# Altium schematic sheet Pressure_OUTPUT.SchDoc
size A4
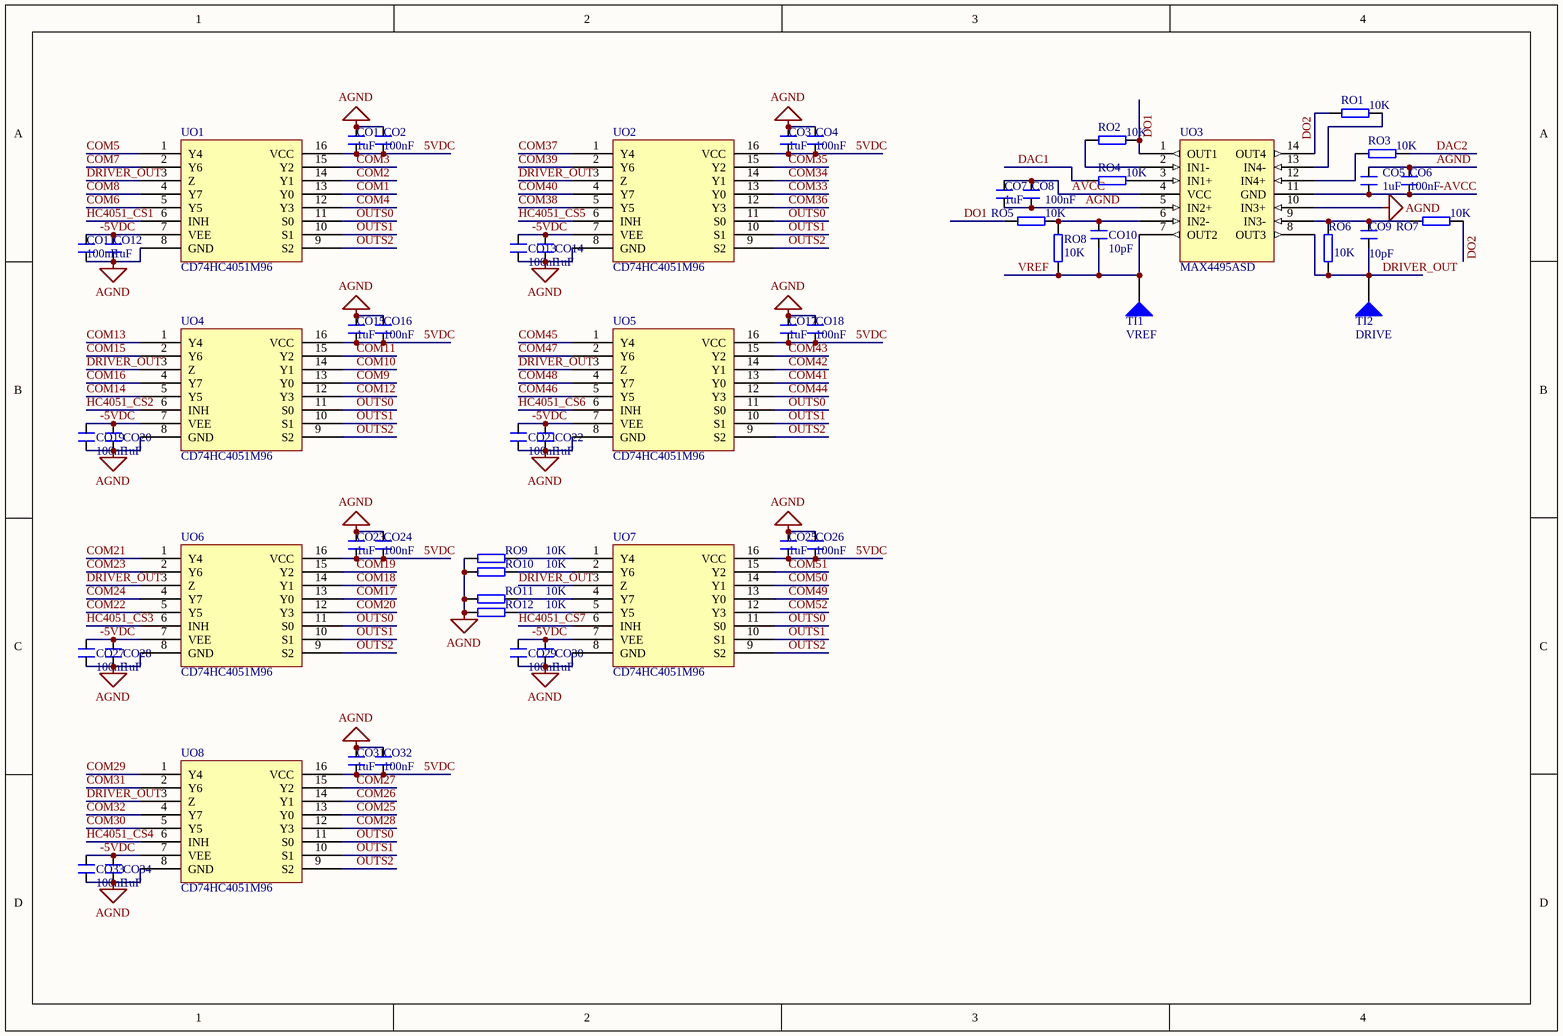
[diagram p0: Pressure_OUTPUT.SchDoc]

## Parts
CO1  1uF  [C0603_HSC100]
CO2  100nF  [C0603_HSC100]
CO3  1uF  [C0603_HSC100]
CO4  100nF  [C0603_HSC100]
CO5  1uF  [C0603_HSC100]
CO6  100nF  [C0603_HSC100]
CO7  1uF  [C0603_HSC100]
CO8  100nF  [C0603_HSC100]
CO9  10pF  [C0603_HSC100]
CO10  10pF  [C0603_HSC100]
CO11  100nF  [C0603_HSC100]
CO12  1uF  [C0603_HSC100]
CO13  100nF  [C0603_HSC100]
CO14  1uF  [C0603_HSC100]
CO15  1uF  [C0603_HSC100]
CO16  100nF  [C0603_HSC100]
CO17  1uF  [C0603_HSC100]
CO18  100nF  [C0603_HSC100]
CO19  100nF  [C0603_HSC100]
CO20  1uF  [C0603_HSC100]
CO21  100nF  [C0603_HSC100]
CO22  1uF  [C0603_HSC100]
CO23  1uF  [C0603_HSC100]
CO24  100nF  [C0603_HSC100]
CO25  1uF  [C0603_HSC100]
CO26  100nF  [C0603_HSC100]
CO27  100nF  [C0603_HSC100]
CO28  1uF  [C0603_HSC100]
CO29  100nF  [C0603_HSC100]
CO30  1uF  [C0603_HSC100]
CO31  1uF  [C0603_HSC100]
CO32  100nF  [C0603_HSC100]
CO33  100nF  [C0603_HSC100]
CO34  1uF  [C0603_HSC100]
RO1  10K  [R0603_HSC100]
RO2  10K  [R0603_HSC100]
RO3  10K  [R0603_HSC100]
RO4  10K  [R0603_HSC100]
RO5  10K  [R0603_HSC100]
RO6  10K  [R0603_HSC100]
RO7  10K  [R0603_HSC100]
RO8  10K  [R0603_HSC100]
RO9  10K  [R0603_HSC100]
RO10  10K  [R0603_HSC100]
RO11  10K  [R0603_HSC100]
RO12  10K  [R0603_HSC100]
TI1  VREF  [TPAD-2MM]
TI2  DRIVE  [TPAD-2MM]
UO1  CD74HC4051M96  [SO-16]
UO2  CD74HC4051M96  [SO-16]
UO3  MAX4495ASD  [SO-14]
UO4  CD74HC4051M96  [SO-16]
UO5  CD74HC4051M96  [SO-16]
UO6  CD74HC4051M96  [SO-16]
UO7  CD74HC4051M96  [SO-16]
UO8  CD74HC4051M96  [SO-16]

## Nets
AGND: CO1.1 CO2.1 CO3.1 CO4.1 CO5.1 CO6.1 CO7.2 CO8.2 CO11.1 CO12.1 CO13.1 CO14.1 CO15.1 CO16.1 CO17.1 CO18.1 CO19.1 CO20.1 CO21.1 CO22.1 CO23.1 CO24.1 CO25.1 CO26.1 CO27.1 CO28.1 CO29.1 CO30.1 CO31.1 CO32.1 CO33.1 CO34.1 RO9.1 RO10.1 RO11.1 RO12.1 UO1.8(GND) UO2.8(GND) UO3.5(IN2+) UO3.10(IN3+) UO4.8(GND) UO5.8(GND) UO6.8(GND) UO7.8(GND) UO8.8(GND)
5VDC: CO1.2 CO2.2 CO3.2 CO4.2 CO15.2 CO16.2 CO17.2 CO18.2 CO23.2 CO24.2 CO25.2 CO26.2 CO31.2 CO32.2 UO1.16(VCC) UO2.16(VCC) UO4.16(VCC) UO5.16(VCC) UO6.16(VCC) UO7.16(VCC) UO8.16(VCC)
-5VDC: CO11.2 CO12.2 CO13.2 CO14.2 CO19.2 CO20.2 CO21.2 CO22.2 CO27.2 CO28.2 CO29.2 CO30.2 CO33.2 CO34.2 UO1.7(VEE) UO2.7(VEE) UO4.7(VEE) UO5.7(VEE) UO6.7(VEE) UO7.7(VEE) UO8.7(VEE)
-AVCC: CO5.2 CO6.2 UO3.11(GND)
AVCC: CO7.1 CO8.1 UO3.4(VCC)
COM1: UO1.13(Y0)
COM2: UO1.14(Y1)
COM3: UO1.15(Y2)
COM4: UO1.12(Y3)
COM5: UO1.1(Y4)
COM6: UO1.5(Y5)
COM7: UO1.2(Y6)
COM8: UO1.4(Y7)
COM9: UO4.13(Y0)
COM10: UO4.14(Y1)
COM11: UO4.15(Y2)
COM12: UO4.12(Y3)
COM13: UO4.1(Y4)
COM14: UO4.5(Y5)
COM15: UO4.2(Y6)
COM16: UO4.4(Y7)
COM17: UO6.13(Y0)
COM18: UO6.14(Y1)
COM19: UO6.15(Y2)
COM20: UO6.12(Y3)
COM21: UO6.1(Y4)
COM22: UO6.5(Y5)
COM23: UO6.2(Y6)
COM24: UO6.4(Y7)
COM25: UO8.13(Y0)
COM26: UO8.14(Y1)
COM27: UO8.15(Y2)
COM28: UO8.12(Y3)
COM29: UO8.1(Y4)
COM30: UO8.5(Y5)
COM31: UO8.2(Y6)
COM32: UO8.4(Y7)
COM33: UO2.13(Y0)
COM34: UO2.14(Y1)
COM35: UO2.15(Y2)
COM36: UO2.12(Y3)
COM37: UO2.1(Y4)
COM38: UO2.5(Y5)
COM39: UO2.2(Y6)
COM40: UO2.4(Y7)
COM41: UO5.13(Y0)
COM42: UO5.14(Y1)
COM43: UO5.15(Y2)
COM44: UO5.12(Y3)
COM45: UO5.1(Y4)
COM46: UO5.5(Y5)
COM47: UO5.2(Y6)
COM48: UO5.4(Y7)
COM49: UO7.13(Y0)
COM50: UO7.14(Y1)
COM51: UO7.15(Y2)
COM52: UO7.12(Y3)
DAC1: RO4.1
DAC2: RO3.1
DO1: RO2.2 RO5.2 UO3.1(OUT1)
DO2: RO1.2 RO7.1 UO3.14(OUT4)
DRIVER_OUT: CO9.2 RO6.2 TI2.1 UO1.3(Z) UO2.3(Z) UO3.8(OUT3) UO4.3(Z) UO5.3(Z) UO6.3(Z) UO7.3(Z) UO8.3(Z)
HC4051_CS1: UO1.6(INH)
HC4051_CS2: UO4.6(INH)
HC4051_CS3: UO6.6(INH)
HC4051_CS4: UO8.6(INH)
HC4051_CS5: UO2.6(INH)
HC4051_CS6: UO5.6(INH)
HC4051_CS7: UO7.6(INH)
OUTS0: UO1.11(S0) UO2.11(S0) UO4.11(S0) UO5.11(S0) UO6.11(S0) UO7.11(S0) UO8.11(S0)
OUTS1: UO1.10(S1) UO2.10(S1) UO4.10(S1) UO5.10(S1) UO6.10(S1) UO7.10(S1) UO8.10(S1)
OUTS2: UO1.9(S2) UO2.9(S2) UO4.9(S2) UO5.9(S2) UO6.9(S2) UO7.9(S2) UO8.9(S2)
VREF: CO10.2 RO8.1 TI1.1 UO3.7(OUT2)
NetCO9_1: CO9.1 RO6.1 RO7.2 UO3.9(IN3-)
NetCO10_1: CO10.1 RO5.1 RO8.2 UO3.6(IN2-)
NetRO1_1: RO1.1 UO3.13(IN4-)
NetRO2_1: RO2.1 UO3.2(IN1-)
NetRO3_2: RO3.2 UO3.12(IN4+)
NetRO4_2: RO4.2 UO3.3(IN1+)
NetRO9_2: RO9.2 UO7.1(Y4)
NetRO10_2: RO10.2 UO7.2(Y6)
NetRO11_2: RO11.2 UO7.4(Y7)
NetRO12_2: RO12.2 UO7.5(Y5)

## Library data of the parts
CO1-CO34 = CAP_M
RO1-RO8 = RES
RO9-RO12 = RES_M
TI1 TI2 = TPAD: Connector
UO1 UO2 UO4-UO8 = 74HC4051
UO3 = LM324